# Altium schematic sheet Mosfet_Driver.SchDoc
size A4; SheetNumber: 7; SheetTotal: 9
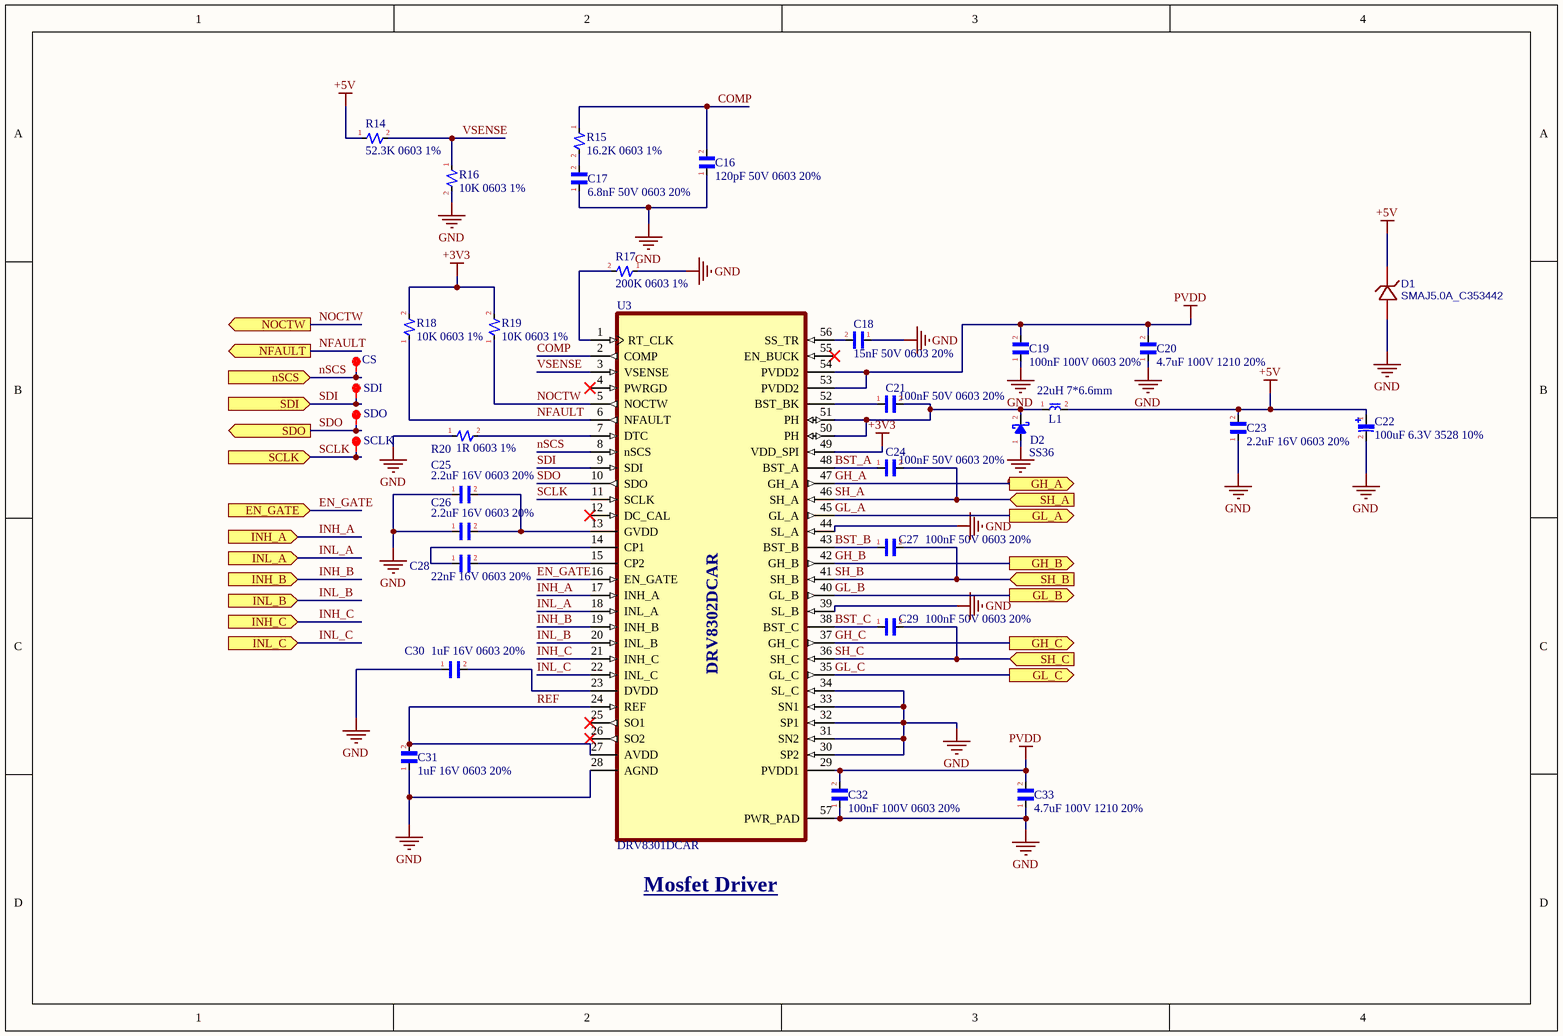
[diagram p0: Mosfet_Driver.SchDoc]

## Parts
C16  120pF 50V 0603 20%  [C_0603]
C17  6.8nF 50V 0603 20%  [C_0603]
C18  15nF 50V 0603 20%  [C_0603]
C19  100nF 100V 0603 20%  [C_0603]
C20  4.7uF 100V 1210 20%  [C_1210]
C21  100nF 50V 0603 20%  [C_0603]
C22  100uF 6.3V 3528 10%  [CAPPC3528X210N]
C23  2.2uF 16V 0603 20%  [C_0603]
C24  100nF 50V 0603 20%  [C_0603]
C25  2.2uF 16V 0603 20%  [C_0603]
C26  2.2uF 16V 0603 20%  [C_0603]
C27  100nF 50V 0603 20%  [C_0603]
C28  22nF 16V 0603 20%  [C_0603]
C29  100nF 50V 0603 20%  [C_0603]
C30  1uF 16V 0603 20%  [C_0603]
C31  1uF 16V 0603 20%  [C_0603]
C32  100nF 100V 0603 20%  [C_0603]
C33  4.7uF 100V 1210 20%  [C_1210]
D1  SMAJ5.0A_C353442  [SMAJ5.0A]
D2  SS36  [SS54]
L1  22uH 7*6.6mm  [Inductor_SMD_7*6.6mm_22uH]
R14  52.3K 0603 1%  [R_0603]
R15  16.2K 0603 1%  [R_0603]
R16  10K 0603 1%  [R_0603]
R17  200K 0603 1%  [R_0603]
R18  10K 0603 1%  [R_0603]
R19  10K 0603 1%  [R_0603]
R20  1R 0603 1%  [R_0603]
TP45  CS  [TP_1mm_SMD]  (graphical)
TP46  SDI  [TP_1mm_SMD]  (graphical)
TP47  SDO  [TP_1mm_SMD]  (graphical)
TP48  SCLK  [TP_1mm_SMD]  (graphical)
U3  DRV8301DCAR  [TSSOP-56_3]

## Ports
EN_GATE (in, see TurboSpin[3B], Mcu[4B]), GH_A (out, see TurboSpin[3C]), GH_B (out, see TurboSpin[3C]), GH_C (out, see TurboSpin[3D]), GL_A (out, see TurboSpin[3C]), GL_B (out, see TurboSpin[3C]), GL_C (out, see TurboSpin[3D]), INH_A (in, see TurboSpin[3B], Mcu[4B]), INH_B (in, see TurboSpin[3B], Mcu[4B]), INH_C (in, see TurboSpin[3B], Mcu[4B]), INL_A (in, see TurboSpin[3B], Mcu[4B]), INL_B (in, see TurboSpin[3B], Mcu[4B]), INL_C (in, see TurboSpin[3B], Mcu[4B]), NFAULT (out, see TurboSpin[3B], Mcu[3C]), NOCTW (out, see TurboSpin[3B], Mcu[3A]), nSCS (in, see TurboSpin[3B], Mcu[3A]), SCLK (in, see TurboSpin[3B], Mcu[3A]), SDI (in, see TurboSpin[3C], Mcu[3A]), SDO (out, see TurboSpin[3C], Mcu[3A]), SH_A (in, see TurboSpin[3C]), SH_B (in, see TurboSpin[3C]), SH_C (in, see TurboSpin[3D])

## Nets
+3V3: R18.2 R19.2 U3.49(VDD_SPI)
+5V: C22.1 C23.2 D1.1(C) L1.2 R14.1
GND: C16.1 C17.1 C18.1 C19.1 C20.1 C22.2 C23.1 C25.1 C26.1 C30.1 C31.1 C32.1 C33.1 D1.2(A) D2.1(A1) R16.2 R17.1 R20.1 U3.28(AGND) U3.30(SP2) U3.31(SN2) U3.32(SP1) U3.33(SN1) U3.34(SL_C) U3.39(SL_B) U3.44(SL_A) U3.57(PWR_PAD)
PVDD: C19.2 C20.2 C32.2 C33.2 U3.29(PVDD1) U3.53(PVDD2) U3.54(PVDD2)
BST_A: C24.1 U3.48(BST_A)
BST_B: C27.1 U3.43(BST_B)
BST_C: C29.1 U3.38(BST_C)
COMP: C16.2 R15.1 U3.2(COMP)
EN_GATE: U3.16(EN_GATE) ; port EN_GATE
GH_A: U3.47(GH_A) ; port GH_A
GH_B: U3.42(GH_B) ; port GH_B
GH_C: U3.37(GH_C) ; port GH_C
GL_A: U3.45(GL_A) ; port GL_A
GL_B: U3.40(GL_B) ; port GL_B
GL_C: U3.35(GL_C) ; port GL_C
INH_A: U3.17(INH_A) ; port INH_A
INH_B: U3.19(INH_B) ; port INH_B
INH_C: U3.21(INH_C) ; port INH_C
INL_A: U3.18(INL_A) ; port INL_A
INL_B: U3.20(INL_B) ; port INL_B
INL_C: U3.22(INL_C) ; port INL_C
NFAULT: R18.1 U3.6(NFAULT) ; port NFAULT
NOCTW: R19.1 U3.5(NOCTW) ; port NOCTW
nSCS: TP45.1 U3.8(nSCS) ; port nSCS
REF: C31.2 U3.24(REF) U3.27(AVDD)
SCLK: TP48.1 U3.11(SCLK) ; port SCLK
SDI: TP46.1 U3.9(SDI) ; port SDI
SDO: TP47.1 U3.10(SDO) ; port SDO
SH_A: C24.2 U3.46(SH_A) ; port SH_A
SH_B: C27.2 U3.41(SH_B) ; port SH_B
SH_C: C29.2 U3.36(SH_C) ; port SH_C
VSENSE: R14.2 R16.1 U3.3(VSENSE)
NetC17_2: C17.2 R15.2
NetC18_2: C18.2 U3.56(SS_TR)
NetC21_1: C21.1 U3.52(BST_BK)
NetC21_2: C21.2 D2.2(K) L1.1 U3.50(PH) U3.51(PH)
NetC25_2: C25.2 C26.2 U3.13(GVDD)
NetC28_1: C28.1 U3.14(CP1)
NetC28_2: C28.2 U3.15(CP2)
NetC30_2: C30.2 U3.23(DVDD)
NetR17_2: R17.2 U3.1(RT_CLK)
NetR20_2: R20.2 U3.7(DTC)

Not connected (* = marked no-connect by the designer): U3 4(PWRGD)* 12(DC_CAL)* 25(SO1)* 26(SO2)* 55(EN_BUCK)*

## Notes on the sheet
- Mosfet Driver

## Library data of the parts
C16-C21 C23-C33 = Capacitor>> Non-Polar: CAP  0603 20%
C22 = Capacitor>> Polar
D1 = SMAJ5.0A_C353442: BOM_Manufacturer: Shandong Jingdao Microelectronics; Contributor: LCSC; BOM_Supplier: LCSC; BOM_Supplier Part: C353442; BOM_Manufacturer Part: SMAJ5.0A; spicePre: D; spiceSymbolName: SMAJ5.0A_C353442
D2 = Diode>>SCHOTTKEY
L1 = Inductor>> General Purpose
R14-R20 = Resistor>> General Purpose: RES 0603 20%
TP45-TP48 = Test point TP
U3 = DRV8301DCAR: Motor Driver Power MOSFET Parallel 56-HTSSOP; MF: Texas Instruments; MP: DRV8302DCAR; Package: HTSSOP-56 Texas Instruments; Digi-Key_Purchase_URL: https://www.digikey.com/product-detail/en/texas-instruments/DRV8302DCAR/296-29544-1-ND/2753591?utm_source=snapeda&utm_medium=aggregator&utm_campaign=symbol; Value: *; SnapEDA_Link: https://www.snapeda.com/parts/DRV8302DCAR/Texas%20Instruments/view-part/46250/?ref=snap; Digi-Key_Part_Number: 296-29544-1-ND